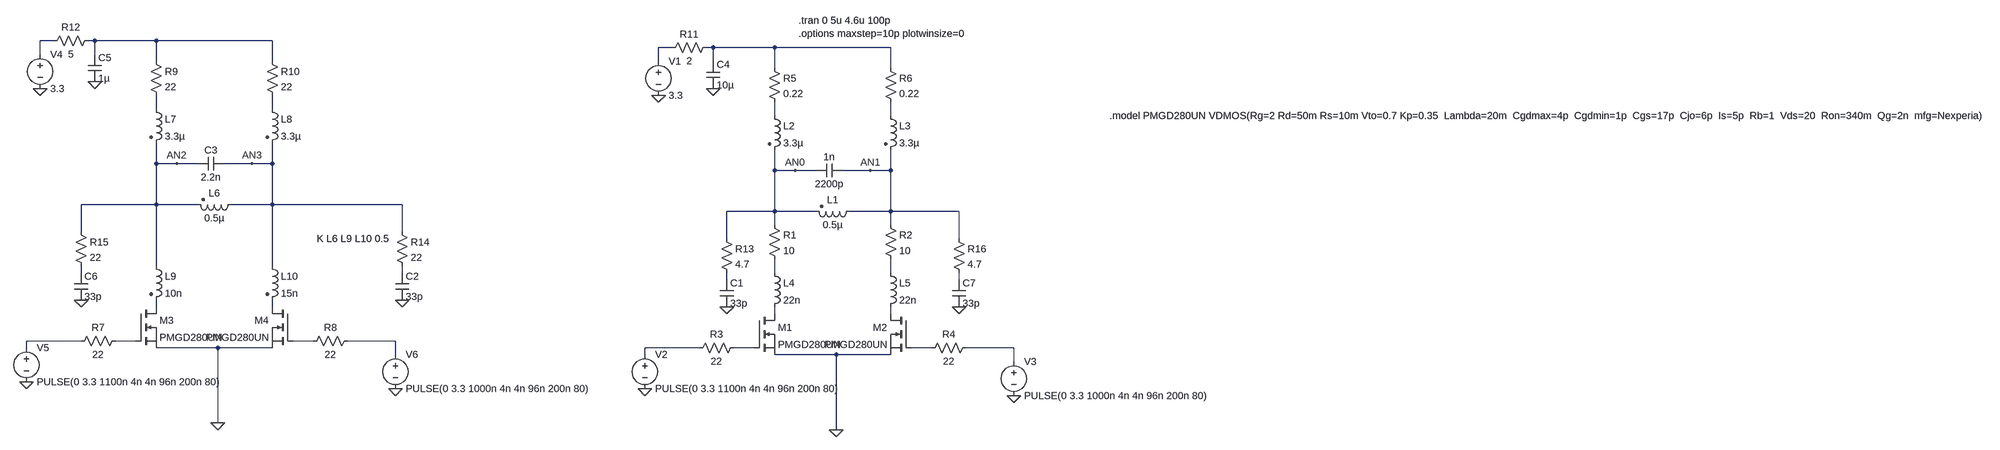
[diagram p0: schematic resonant-transmitter-an138-v2.asc]
resonant-transmitter-an138-v2.asc, the LTspice schematic file:
Version 4
SHEET 1 3092 720
WIRE -1568 -208 -1600 -208
WIRE -1472 -208 -1488 -208
WIRE -1328 -208 -1472 -208
WIRE -1056 -208 -1328 -208
WIRE 32 -192 0 -192
WIRE 128 -192 112 -192
WIRE 272 -192 128 -192
WIRE 544 -192 272 -192
WIRE -1600 -176 -1600 -208
WIRE -1472 -176 -1472 -208
WIRE -1328 -160 -1328 -208
WIRE -1056 -160 -1056 -208
WIRE 0 -160 0 -192
WIRE 128 -160 128 -192
WIRE 272 -144 272 -192
WIRE 544 -144 544 -192
WIRE -1328 -48 -1328 -80
WIRE -1056 -48 -1056 -80
WIRE 272 -32 272 -64
WIRE 544 -32 544 -64
WIRE -1328 80 -1328 32
WIRE -1280 80 -1328 80
WIRE -1232 80 -1280 80
WIRE -1104 80 -1168 80
WIRE -1056 80 -1056 32
WIRE -1056 80 -1104 80
WIRE 272 96 272 48
WIRE 320 96 272 96
WIRE 368 96 320 96
WIRE 496 96 432 96
WIRE 544 96 544 48
WIRE 544 96 496 96
WIRE -1328 176 -1328 80
WIRE -1328 176 -1504 176
WIRE -1232 176 -1328 176
WIRE -1056 176 -1056 80
WIRE -1056 176 -1152 176
WIRE -752 176 -1056 176
WIRE 272 192 272 96
WIRE 272 192 160 192
WIRE 368 192 272 192
WIRE 544 192 544 96
WIRE 544 192 448 192
WIRE 704 192 544 192
WIRE 272 224 272 192
WIRE 544 224 544 192
WIRE -1504 240 -1504 176
WIRE -752 240 -752 176
WIRE 160 256 160 192
WIRE 704 256 704 192
WIRE -1328 320 -1328 176
WIRE -1056 320 -1056 176
WIRE -1504 336 -1504 320
WIRE -752 336 -752 320
WIRE 272 336 272 304
WIRE 544 336 544 304
WIRE 160 352 160 336
WIRE 704 352 704 336
WIRE -1328 416 -1328 400
WIRE -1056 416 -1056 400
WIRE 272 432 272 416
WIRE 544 432 544 416
WIRE -1504 496 -1632 496
WIRE -1376 496 -1424 496
WIRE -960 496 -1008 496
WIRE -768 496 -880 496
WIRE -1632 512 -1632 496
WIRE -1184 512 -1328 512
WIRE -1056 512 -1184 512
WIRE 96 512 -32 512
WIRE 224 512 176 512
WIRE 640 512 592 512
WIRE 832 512 720 512
WIRE -768 528 -768 496
WIRE -32 528 -32 512
WIRE 416 528 272 528
WIRE 544 528 416 528
WIRE 832 544 832 512
WIRE -1184 688 -1184 512
WIRE 416 704 416 528
FLAG -32 608 0
FLAG 832 624 0
FLAG 0 -80 0
FLAG 416 704 0
FLAG 320 96 AN0
FLAG 496 96 AN1
FLAG 128 -96 0
FLAG -1632 592 0
FLAG -768 608 0
FLAG -1600 -96 0
FLAG -1184 688 0
FLAG -1280 80 AN2
FLAG -1104 80 AN3
FLAG -1472 -112 0
FLAG 160 416 0
FLAG -752 400 0
FLAG -1504 400 0
FLAG 704 416 0
SYMBOL nmos 224 432 R0
SYMATTR InstName M1
SYMATTR Value PMGD280UN
SYMBOL nmos 592 432 M0
SYMATTR InstName M2
SYMATTR Value PMGD280UN
SYMBOL ind2 464 176 R90
WINDOW 0 5 56 VBottom 2
WINDOW 3 32 56 VTop 2
SYMATTR InstName L1
SYMATTR Value 0.5µ
SYMATTR SpiceLine Rser=1.3
SYMATTR Type ind
SYMBOL cap 432 80 R90
WINDOW 0 0 32 VBottom 2
WINDOW 3 32 32 VTop 2
SYMATTR InstName 1n
SYMATTR Value 2200p
SYMBOL voltage 0 -176 R0
SYMATTR InstName V1
SYMATTR Value 3.3
SYMBOL voltage -32 512 R0
SYMATTR InstName V2
SYMATTR Value PULSE(0 3.3 1100n 4n 4n 96n 200n 80)
SYMBOL voltage 832 528 R0
SYMATTR InstName V3
SYMATTR Value PULSE(0 3.3 1000n 4n 4n 96n 200n 80)
SYMBOL res 192 496 R90
WINDOW 0 0 56 VBottom 2
WINDOW 3 32 56 VTop 2
SYMATTR InstName R3
SYMATTR Value 22
SYMBOL res 736 496 R90
WINDOW 0 0 56 VBottom 2
WINDOW 3 32 56 VTop 2
SYMATTR InstName R4
SYMATTR Value 22
SYMBOL ind2 256 -48 R0
SYMATTR InstName L2
SYMATTR Value 3.3µ
SYMATTR Type ind
SYMATTR SpiceLine Rser=1 Cpar=1.5p
SYMBOL ind2 528 -48 R0
SYMATTR InstName L3
SYMATTR Value 3.3µ
SYMATTR Type ind
SYMATTR SpiceLine Rser=1 Cpar=1.5p
SYMBOL res 256 -160 R0
SYMATTR InstName R5
SYMATTR Value 0.22
SYMBOL res 528 -160 R0
SYMATTR InstName R6
SYMATTR Value 0.22
SYMBOL cap 112 -160 R0
SYMATTR InstName C4
SYMATTR Value 10µ
SYMBOL res 128 -208 R90
WINDOW 0 0 56 VBottom 2
WINDOW 3 32 56 VTop 2
SYMATTR InstName R11
SYMATTR Value 2
SYMBOL ind 256 320 R0
SYMATTR InstName L4
SYMATTR Value 22n
SYMBOL ind 528 320 R0
SYMATTR InstName L5
SYMATTR Value 22n
SYMBOL res 256 208 R0
SYMATTR InstName R1
SYMATTR Value 10
SYMBOL res 528 208 R0
SYMATTR InstName R2
SYMATTR Value 10
SYMBOL nmos -1376 416 R0
SYMATTR InstName M3
SYMATTR Value PMGD280UN
SYMBOL nmos -1008 416 M0
SYMATTR InstName M4
SYMATTR Value PMGD280UN
SYMBOL ind2 -1136 160 R90
WINDOW 0 5 56 VBottom 2
WINDOW 3 32 56 VTop 2
SYMATTR InstName L6
SYMATTR Value 0.5µ
SYMATTR SpiceLine Rser=1.3
SYMATTR Type ind
SYMBOL cap -1168 64 R90
WINDOW 0 0 32 VBottom 2
WINDOW 3 32 32 VTop 2
SYMATTR InstName C3
SYMATTR Value 2.2n
SYMBOL voltage -1600 -192 R0
SYMATTR InstName V4
SYMATTR Value 3.3
SYMBOL voltage -1632 496 R0
SYMATTR InstName V5
SYMATTR Value PULSE(0 3.3 1100n 4n 4n 96n 200n 80)
SYMBOL voltage -768 512 R0
SYMATTR InstName V6
SYMATTR Value PULSE(0 3.3 1000n 4n 4n 96n 200n 80)
SYMBOL res -1408 480 R90
WINDOW 0 0 56 VBottom 2
WINDOW 3 32 56 VTop 2
SYMATTR InstName R7
SYMATTR Value 22
SYMBOL res -864 480 R90
WINDOW 0 0 56 VBottom 2
WINDOW 3 32 56 VTop 2
SYMATTR InstName R8
SYMATTR Value 22
SYMBOL ind2 -1344 -64 R0
SYMATTR InstName L7
SYMATTR Value 3.3µ
SYMATTR Type ind
SYMATTR SpiceLine Rser=1 Cpar=1.5p
SYMBOL ind2 -1072 -64 R0
SYMATTR InstName L8
SYMATTR Value 3.3µ
SYMATTR Type ind
SYMATTR SpiceLine Rser=1 Cpar=1.5p
SYMBOL res -1344 -176 R0
SYMATTR InstName R9
SYMATTR Value 22
SYMBOL res -1072 -176 R0
SYMATTR InstName R10
SYMATTR Value 22
SYMBOL cap -1488 -176 R0
SYMATTR InstName C5
SYMATTR Value 1µ
SYMBOL res -1472 -224 R90
WINDOW 0 0 56 VBottom 2
WINDOW 3 32 56 VTop 2
SYMATTR InstName R12
SYMATTR Value 5
SYMBOL ind2 -1344 304 R0
SYMATTR InstName L9
SYMATTR Value 10n
SYMATTR Type ind
SYMBOL ind2 -1072 304 R0
SYMATTR InstName L10
SYMATTR Value 15n
SYMATTR Type ind
SYMBOL res 144 240 R0
SYMATTR InstName R13
SYMATTR Value 4.7
SYMBOL cap 144 352 R0
SYMATTR InstName C1
SYMATTR Value 33p
SYMBOL res -768 224 R0
SYMATTR InstName R14
SYMATTR Value 22
SYMBOL cap -768 336 R0
SYMATTR InstName C2
SYMATTR Value 33p
SYMBOL res -1520 224 R0
SYMATTR InstName R15
SYMATTR Value 22
SYMBOL cap -1520 336 R0
SYMATTR InstName C6
SYMATTR Value 33p
SYMBOL res 688 240 R0
SYMATTR InstName R16
SYMATTR Value 4.7
SYMBOL cap 688 352 R0
SYMATTR InstName C7
SYMATTR Value 33p
TEXT 328 -256 Left 2 !.tran 0 5u 4.6u 100p\n.options maxstep=10p plotwinsize=0
TEXT 1056 -32 Left 2 !.model PMGD280UN VDMOS(Rg=2 Rd=50m Rs=10m Vto=0.7 Kp=0.35  Lambda=20m  Cgdmax=4p  Cgdmin=1p  Cgs=17p  Cjo=6p  Is=5p  Rb=1  Vds=20  Ron=340m  Qg=2n  mfg=Nexperia)
TEXT -952 256 Left 2 !K L6 L9 L10 0.5

The netlist it stands for:
* resonant-transmitter-an138-v2.asc
M1 N017 N024 0 0 PMGD280UN
M2 N018 N025 0 0 PMGD280UN
L1 AN1 AN0 0.5µ Rser=1.3
C§1n AN1 AN0 2200p
V1 N003 0 3.3
V2 N023 0 PULSE(0 3.3 1100n 4n 4n 96n 200n 80)
V3 N026 0 PULSE(0 3.3 1000n 4n 4n 96n 200n 80)
R3 N024 N023 22
R4 N026 N025 22
L2 N007 AN0 3.3µ Rser=1 Cpar=1.5p
L3 N008 AN1 3.3µ Rser=1 Cpar=1.5p
R5 N004 N007 0.22
R6 N004 N008 0.22
C4 N004 0 10µ
R11 N004 N003 2
L4 N011 N017 22n
L5 N012 N018 22n
R1 AN0 N011 10
R2 AN1 N012 10
M3 N015 N020 0 0 PMGD280UN
M4 N016 N021 0 0 PMGD280UN
L6 AN3 AN2 0.5µ Rser=1.3
C3 AN3 AN2 2.2n
V4 N001 0 3.3
V5 N019 0 PULSE(0 3.3 1100n 4n 4n 96n 200n 80)
V6 N022 0 PULSE(0 3.3 1000n 4n 4n 96n 200n 80)
R7 N020 N019 22
R8 N022 N021 22
L7 N005 AN2 3.3µ Rser=1 Cpar=1.5p
L8 N006 AN3 3.3µ Rser=1 Cpar=1.5p
R9 N002 N005 22
R10 N002 N006 22
C5 N002 0 1µ
R12 N002 N001 5
L9 AN2 N015 10n
L10 AN3 N016 15n
R13 AN0 N013 4.7
C1 N013 0 33p
R14 AN3 N010 22
C2 N010 0 33p
R15 AN2 N009 22
C6 N009 0 33p
R16 AN1 N014 4.7
C7 N014 0 33p
.model NMOS NMOS
.model PMOS PMOS
.lib standard.mos
.tran 0 5u 4.6u 100p
.options maxstep=10p plotwinsize=0
.model PMGD280UN VDMOS(Rg=2 Rd=50m Rs=10m Vto=0.7 Kp=0.35  Lambda=20m  Cgdmax=4p  Cgdmin=1p  Cgs=17p  Cjo=6p  Is=5p  Rb=1  Vds=20  Ron=340m  Qg=2n  mfg=Nexperia)
K L6 L9 L10 0.5
.backanno
.end